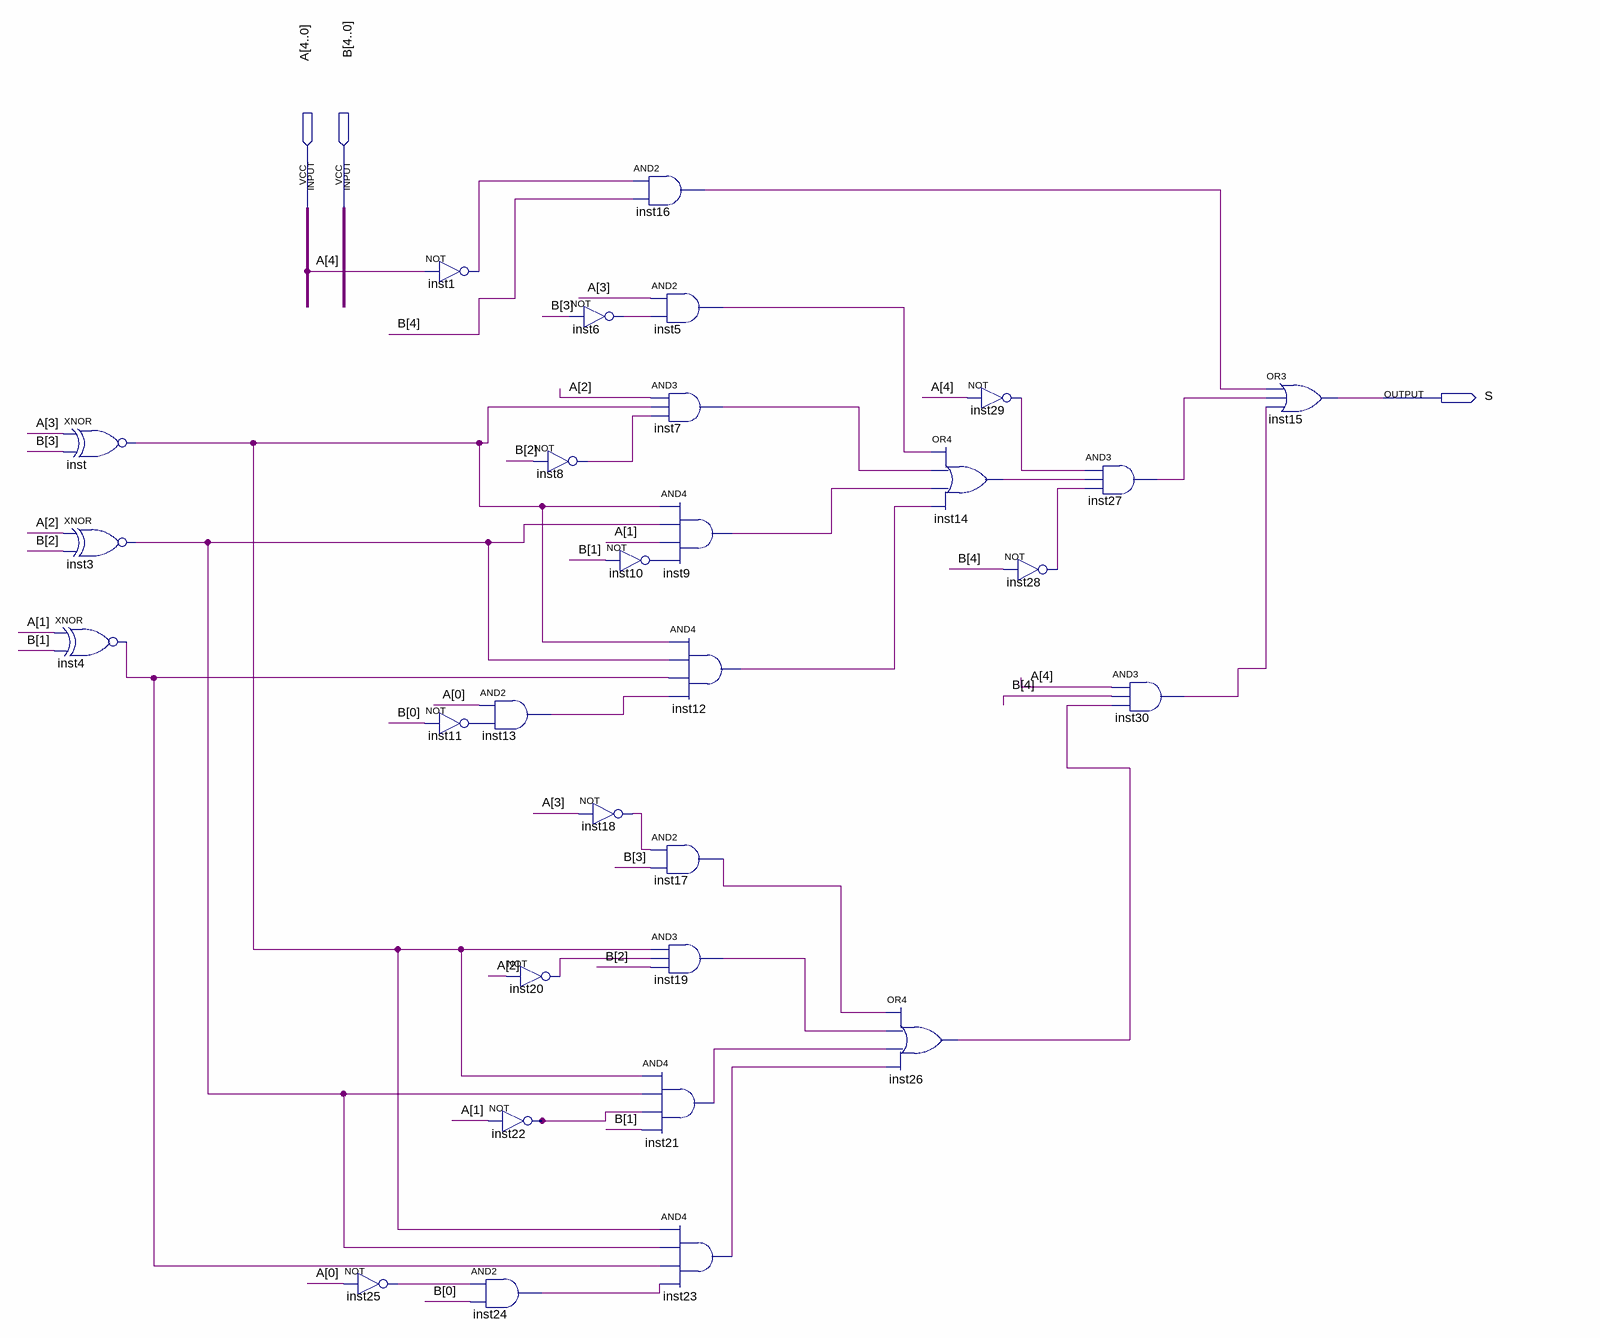
[diagram p0: schematic sheet]
// Quartus schematic comparadores_maiorque.bdf as structural Verilog: 30 symbols, 3 pins
module comparadores_maiorque (
  input  [4:0] A,
  input  [4:0] B,
  output S
);

  wire inst1_out, inst3_out, inst4_out, inst5_out, inst6_out, inst7_out, inst8_out, inst9_out, inst10_out,
       inst11_out, inst12_out, inst13_out, inst14_out, inst16_out, inst17_out, inst18_out, inst19_out,
       inst20_out, inst21_out, inst22_out, inst23_out, inst24_out, inst25_out, inst26_out, inst27_out,
       inst28_out, inst29_out, inst30_out, inst_out;

  xnor inst (inst_out, A[3], B[3]);
  xnor inst3 (inst3_out, A[2], B[2]);
  xnor inst4 (inst4_out, A[1], B[1]);
  not inst25 (inst25_out, A[0]);
  not inst1 (inst1_out, A[4]);
  not inst11 (inst11_out, B[0]);
  and inst13 (inst13_out, A[0], inst11_out);
  not inst20 (inst20_out, A[2]);
  not inst22 (inst22_out, A[1]);
  and inst24 (inst24_out, inst25_out, B[0]);
  not inst6 (inst6_out, B[3]);
  not inst8 (inst8_out, B[2]);
  not inst18 (inst18_out, A[3]);
  and inst16 (inst16_out, inst1_out, B[4]);
  and inst5 (inst5_out, A[3], inst6_out);
  and inst7 (inst7_out, A[2], inst_out, inst8_out);
  and inst9 (inst9_out, inst_out, inst3_out, A[1], inst10_out);
  not inst10 (inst10_out, B[1]);
  and inst12 (inst12_out, inst_out, inst3_out, inst4_out, inst13_out);
  and inst17 (inst17_out, inst18_out, B[3]);
  and inst19 (inst19_out, inst_out, inst20_out, B[2]);
  and inst21 (inst21_out, inst_out, inst3_out, inst22_out, B[1]);
  and inst23 (inst23_out, inst_out, inst3_out, inst4_out, inst24_out);
  or inst26 (inst26_out, inst17_out, inst19_out, inst21_out, inst23_out);
  or inst14 (inst14_out, inst5_out, inst7_out, inst9_out, inst12_out);
  not inst29 (inst29_out, A[4]);
  not inst28 (inst28_out, B[4]);
  and inst27 (inst27_out, inst29_out, inst14_out, inst28_out);
  and inst30 (inst30_out, A[4], B[4], inst26_out);
  or inst15 (S, inst16_out, inst27_out, inst30_out);
endmodule
